# Altium schematic sheet ethernet.SchDoc
size A4; SheetNumber: 2; SheetTotal: 2
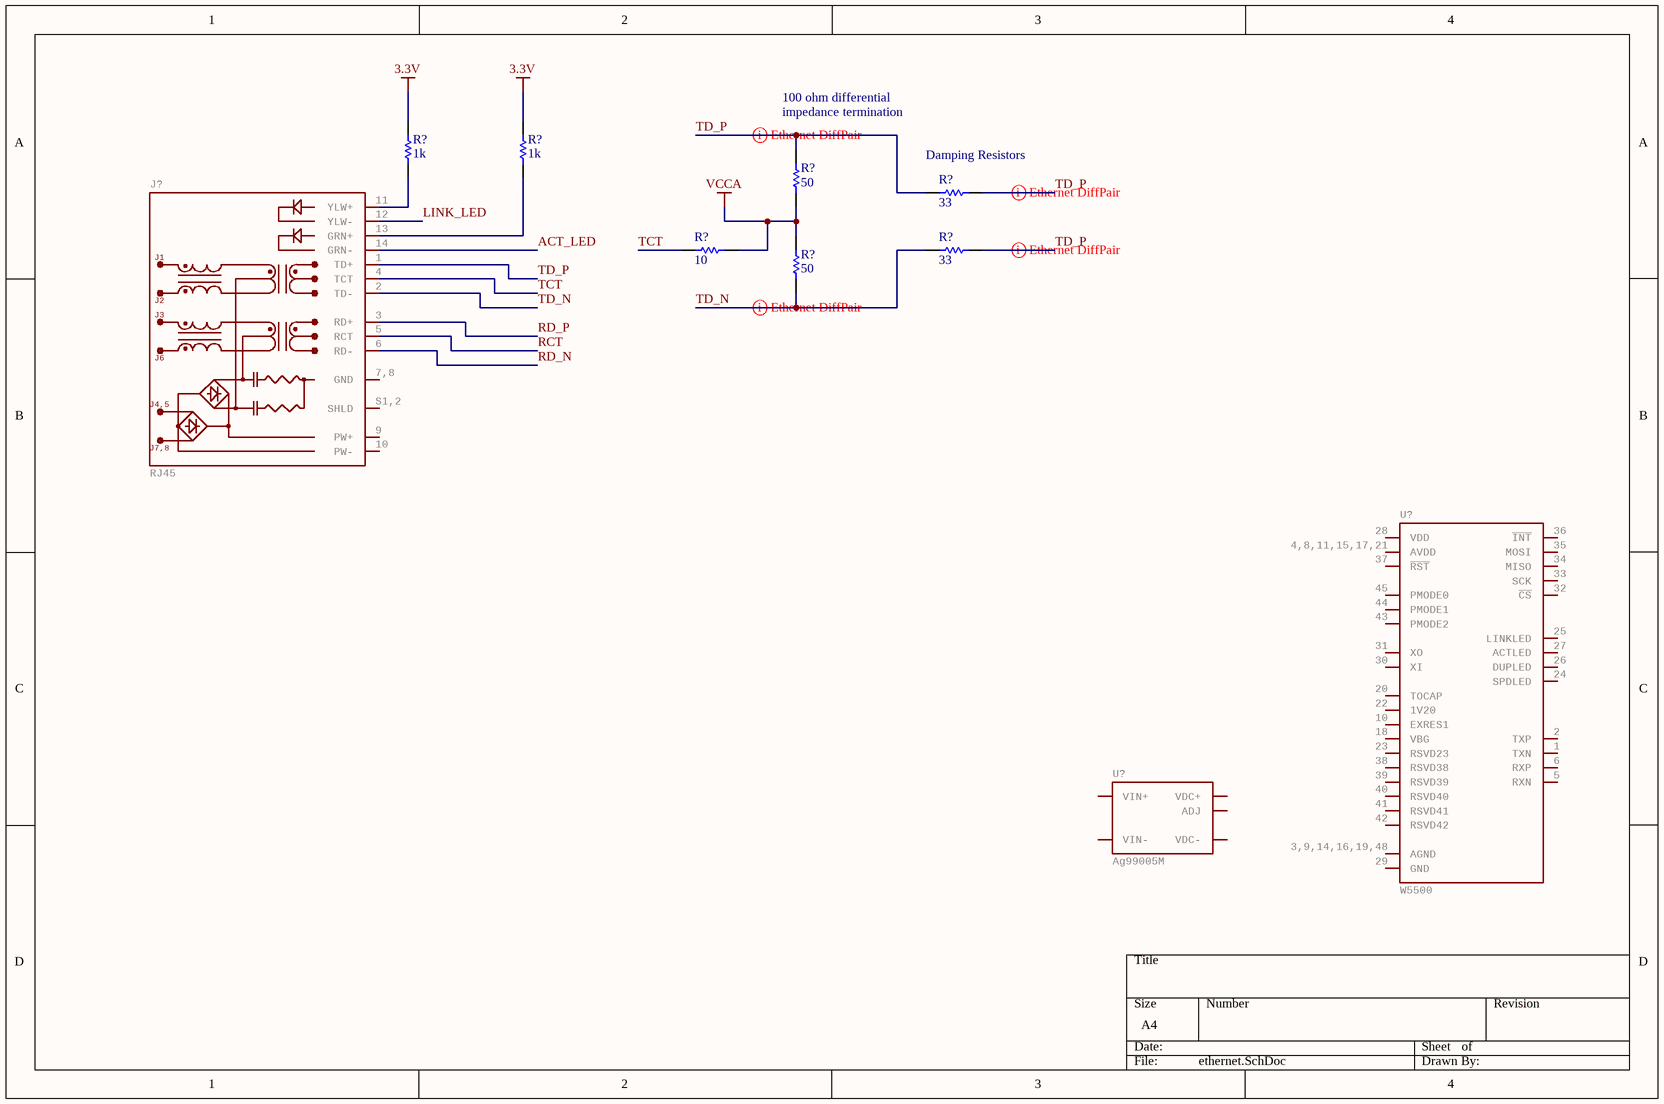
[diagram p0: ethernet.SchDoc]

## Parts
(Parts that share a designator on the sheet are numbered #1, #2 ... from top to bottom, then left to right.)
J?  RJ45  [MAGJACK-SYM_LED]
R?#1  value 1k  [0603 - Resistor]  (hidden comment: Resistor)
R?#2  value 1k  [0603 - Resistor]  (hidden comment: Resistor)
R?#3  value 50  [0603 - Resistor]  (hidden comment: Resistor)
R?#4  value 33  [0603 - Resistor]  (hidden comment: Resistor)
R?#5  value 10  [0603 - Resistor]  (hidden comment: Resistor)
R?#6  value 33  [0603 - Resistor]  (hidden comment: Resistor)
R?#7  value 50  [0603 - Resistor]  (hidden comment: Resistor)
U?#1  W5500  [LQFP-48]
U?#2  Ag99005M  [DP990X]

## Nets
3.3V: R?#1.2 R?#2.2
VCCA: R?#3.1 R?#5.1 R?#7.2
ACT_LED: J?.14(GRN-)
LINK_LED: J?.12(YLW-)
RCT: J?.5(RCT)
RD_N: J?.6(RD-)
RD_P: J?.3(RD+)
TCT: J?.4(TCT) R?#5.2
TD_N: J?.2(TD-) R?#6.2 R?#7.1
TD_P: J?.1(TD+) R?#3.2 R?#4.1 R?#4.2 R?#6.1
NetJ?_11: J?.11(YLW+) R?#1.1
NetJ?_13: J?.13(GRN+) R?#2.1

Not connected (* = marked no-connect by the designer): J? 7,8(GND) 9(PW+) 10(PW-) S1,2(SHLD); U?#1 1(TXN) 2(TXP) 3,9,14,16,19,48(AGND) 4,8,11,15,17,21(AVDD) 5(RXN) 6(RXP) 10(EXRES1) 18(VBG) 20(TOCAP) 22(1V20) 23(RSVD23) 24(SPDLED) 25(LINKLED) 26(DUPLED) 27(ACTLED) 28(VDD) 29(GND) 30(XI) 31(XO) 32(~{CS}) 33(SCK) 34(MISO) 35(MOSI) 36(~{INT}) 37(~{RST}) 38(RSVD38) 39(RSVD39) 40(RSVD40) 41(RSVD41) 42(RSVD42) 43(PMODE2) 44(PMODE1) 45(PMODE0); U?#2 1,2(VDC+) 3(VDC-) 4(ADJ) 5,6(VIN+) 7,8(VIN-)

## Layout directives
differential pair; differential pair class Ethernet: TD_N, TD_P

## Notes on the sheet
- 100 ohm differential
- (near R?#3) impedance termination
- (near R?#4) Damping Resistors

## Library data of the parts
J? = ARJP11A-MASA-B-A-EMU2: GateName_1: J1; SymbolName_1: MAGJACK_POE_SYMMETRICAL; DeviceSetName: MAGJACK-POE; PROD_ID: CONN-16253; LibraryName: SparkFun-Connectors; J1: J1; J2: J2; J3: J3; J6: J6; J4,5: J4,5; J7,8: J7,8
U?#1 = W5500: GateName_1: U1; PROD_ID: IC-16240; SymbolName_1: W5500; LibraryName: SparkFun-IC-Comms; DeviceSetName: W5500
U?#2 = Ag99005M: GateName_1: U1; SymbolName_1: POE_PSU; DeviceName: -DP990X; PROD_ID: IC-16251; LibraryName: SparkFun-IC-Power; DeviceSetName: POE_PSU
R?#1-R?#7 = Resistor: Rating: *; Manufacturer Part Number: *; Manufacturer: *; Supplier Part Number: *; Supplier: *